# EAGLE design DTMF (EAGLE 6.5.0)
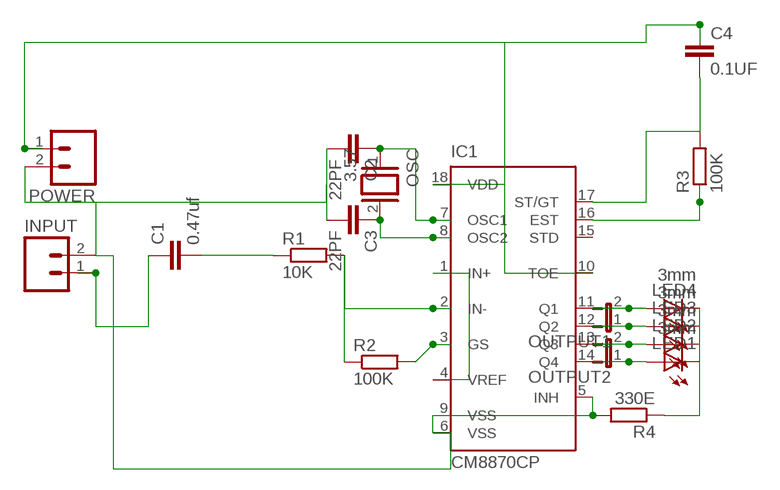
[diagram p0: schematic, sheet 1]

## Parts
C1  0.47uf  C2.5/2  [C2.5-2]
C2  22PF  C2.5/2  [C2.5-2]
C3  22PF  C2.5/2  [C2.5-2]
C4  0.1UF  C2.5/2  [C2.5-2]
IC1  CM8870CP  [DIL18]
INPUT  M02  [02P]
LED1  3mm  LED3MM  [LED3MM]
LED2  3mm  LED3MM  [LED3MM]
LED3  3mm  LED3MM  [LED3MM]
LED4  3mm  LED3MM  [LED3MM]
OSC  3.57  XTAL/S  [QS]
OUTPUT1  JP1E  [JP1]
OUTPUT2  JP1E  [JP1]
POWER  M02  [02P]
R1  10K  R-EU_0204/7  [0204/7]
R2  100K  R-EU_0204/7  [0204/7]
R3  100K  R-EU_0204/7  [0204/7]
R4  330E  R-EU_0204/7  [0204/7]

## Nets
N$1: C2.2 C3.2 IC1.5(INH) IC1.6(VSS) IC1.9(VSS) INPUT.2 POWER.2 R4.2
N$2: C1.2 R1.1
N$3: IC1.3(GS) R2.2
N$4: LED1.K(C) LED2.K(C) LED3.K(C) LED4.K(C) R4.1
N$5: IC1.11(Q1) LED4.A OUTPUT1.2
N$6: IC1.12(Q2) LED3.A OUTPUT1.1
N$7: IC1.13(Q3) LED2.A OUTPUT2.2
N$8: IC1.14(Q4) LED1.A OUTPUT2.1
N$10: C4.1 IC1.10(TOE) IC1.18(VDD) POWER.1
N$11: C1.1 INPUT.1
N$12: IC1.2(IN-) R1.2 R2.1
N$13: IC1.1(IN+) IC1.4(VREF)
N$14: C2.1 IC1.7(OSC1) OSC.1
N$15: C3.1 IC1.8(OSC2) OSC.2
N$17: IC1.16(EST) R3.1
N$24: C4.2 IC1.17(ST/GT) R3.2
Unconnected: IC1.15(STD)

## Library data of the parts
C1-C4 = capacitor-wima:C: CAPACITOR naming: grid - package width
IC1 = california-micro-devices:CM8870C: CMOS Integrated DTMF Receiver cm8870.pdf; OC_FARNELL: unknown; OC_NEWARK: unknown
INPUT POWER = con-amp-quick:M02: AMP QUICK CONNECTOR; OC_FARNELL: unknown; OC_NEWARK: unknown
LED1-LED4 = led:LED: LED OSRAM: - CHIPLED LG R971, LG N971, LY N971, LG Q971, LY Q971, LO R971, LY R971 LH N974, LH R974 LS Q976, LO Q976, LY Q976 LO Q996 - Hyper CHIPLED LW Q18S LB Q993, LB Q99A, LB R99A - SideLED LS A670, LO A670, LY A670, LG A670, LP A670 LB A673, LV A673, LT A673, LW A673 LH A674 LY A675 LS A676, LA A676, LO A676, LY A676, LW A676 LS A679, LY A679, LG A679 - Hyper Micro SIDELED® LS Y876, LA Y876, LO Y876, LY Y876 LT Y87S - SmartLED LW L88C, LW L88S LB L89C, LB L89S, LG L890 LS L89K, LO L89K, LY L89K LS L896, LA L896, LO L896, LY L896 - TOPLED LS T670, LO T670, LY T670, LG T670, LP T670 LSG T670, LSP T670, LSY T670, LOP T670, LYG T670 LG T671, LOG T671, LSG T671 LB T673, LV T673, LT T673, LW T673 LH T674 LS T676, LA T676, LO T676, LY T676, LB T676, LH T676, LSB T676, LW T676 LB T67C, LV T67C, LT T67C, LS T67K, LO T67K, LY T67K, LW E67C LS E67B, LA E67B, LO E67B, LY E67B, LB E67C, LV E67C, LT E67C LW T67C LS T679, LY T679, LG T679 LS T770, LO T770, LY T770, LG T770, LP T770 LB T773, LV T773, LT T773, LW T773 LH T774 LS E675, LA E675, LY E675, LS T675 LS T776, LA T776, LO T776, LY T776, LB T776 LHGB T686 LT T68C, LB T68C - Hyper Mini TOPLED® LB M676 - Mini TOPLED Santana® LG M470 LS M47K, LO M47K, LY M47K Source: http://www.osram.convergy.de LUXEON: - LUMILED® LXK2-PW12-R00, LXK2-PW12-S00, LXK2-PW14-U00, LXK2-PW14-V00 LXK2-PM12-R00, LXK2-PM12-S00, LXK2-PM14-U00 LXK2-PE12-Q00, LXK2-PE12-R00, LXK2-PE12-S00, LXK2-PE14-T00, LXK2-PE14-U00 LXK2-PB12-K00, LXK2-PB12-L00, LXK2-PB12-M00, LXK2-PB14-N00, LXK2-PB14-P00, LXK2-PB14-Q00 LXK2-PR12-L00, LXK2-PR12-M00, LXK2-PR14-Q00, LXK2-PR14-R00 LXK2-PD12-Q00, LXK2-PD12-R00, LXK2-PD12-S00 LXK2-PH12-R00, LXK2-PH12-S00 LXK2-PL12-P00, LXK2-PL12-Q00, LXK2-PL12-R00 Source: www.luxeon.com KINGBRIGHT: KA-3528ASYC Source: www.kingbright.com
OSC = special:XTAL/S: CRYSTAL
OUTPUT1 OUTPUT2 = jumper:JP1E: JUMPER
R1-R4 = rcl:R-EU_: RESISTOR, European symbol

## Board
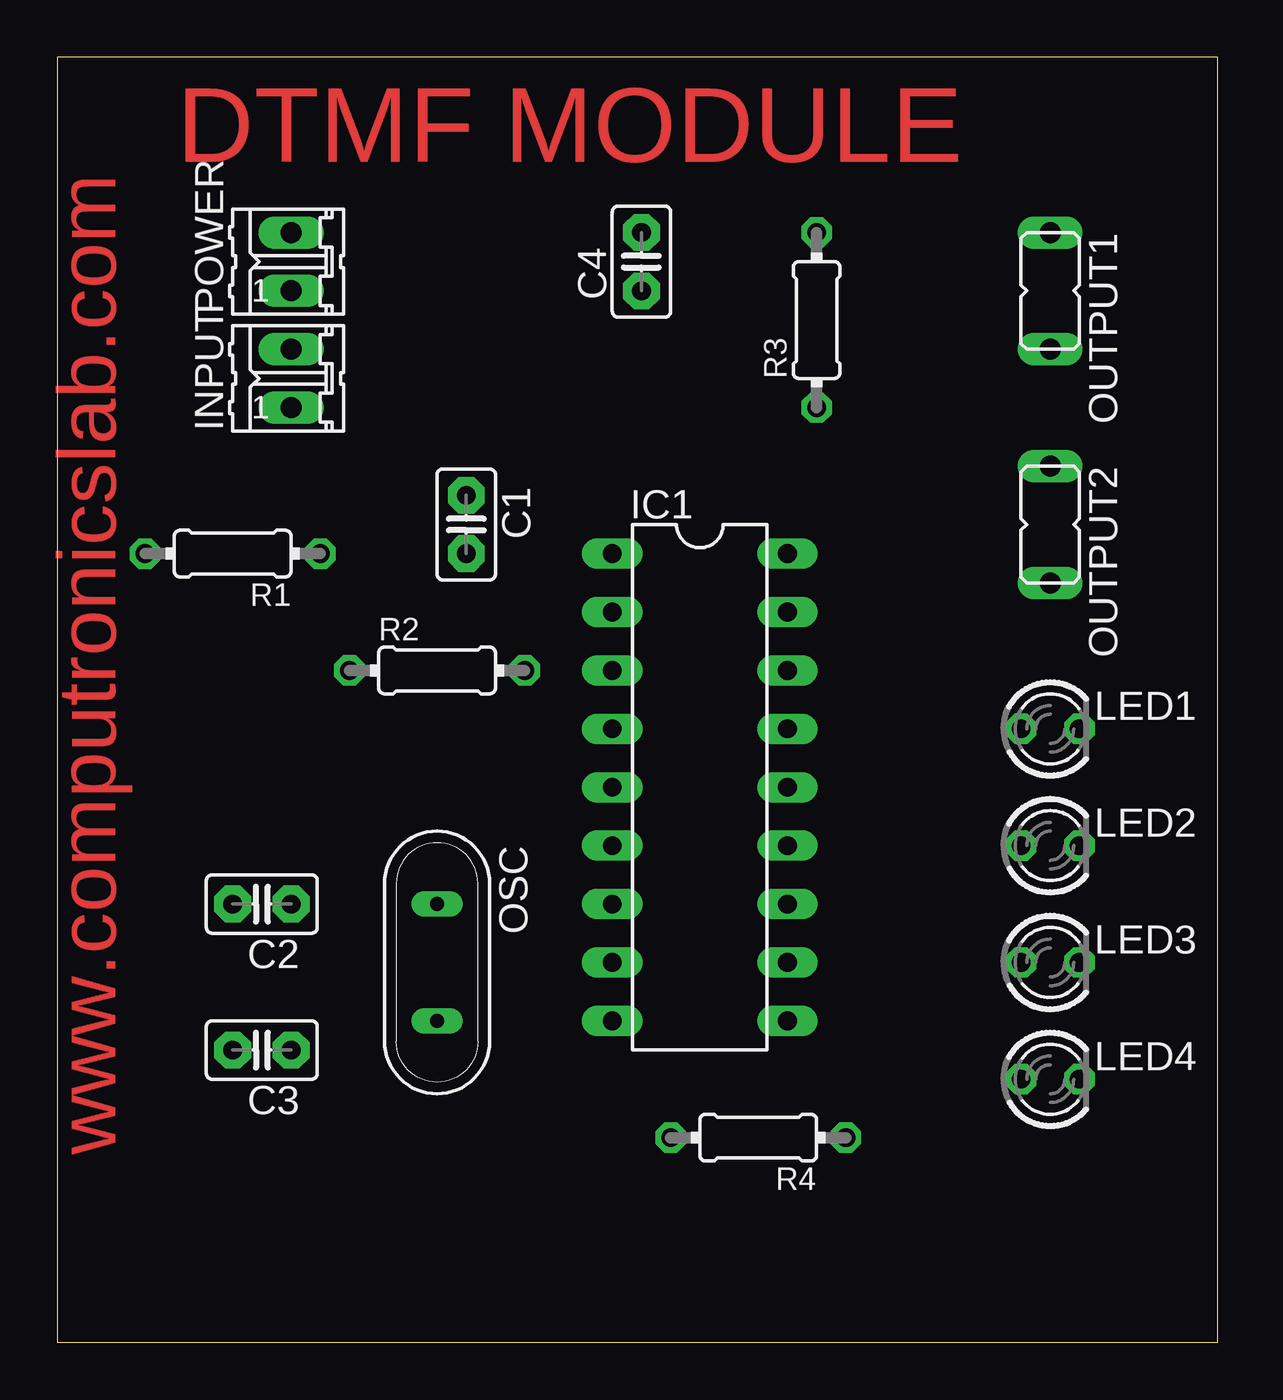
[diagram p1: board, top side]
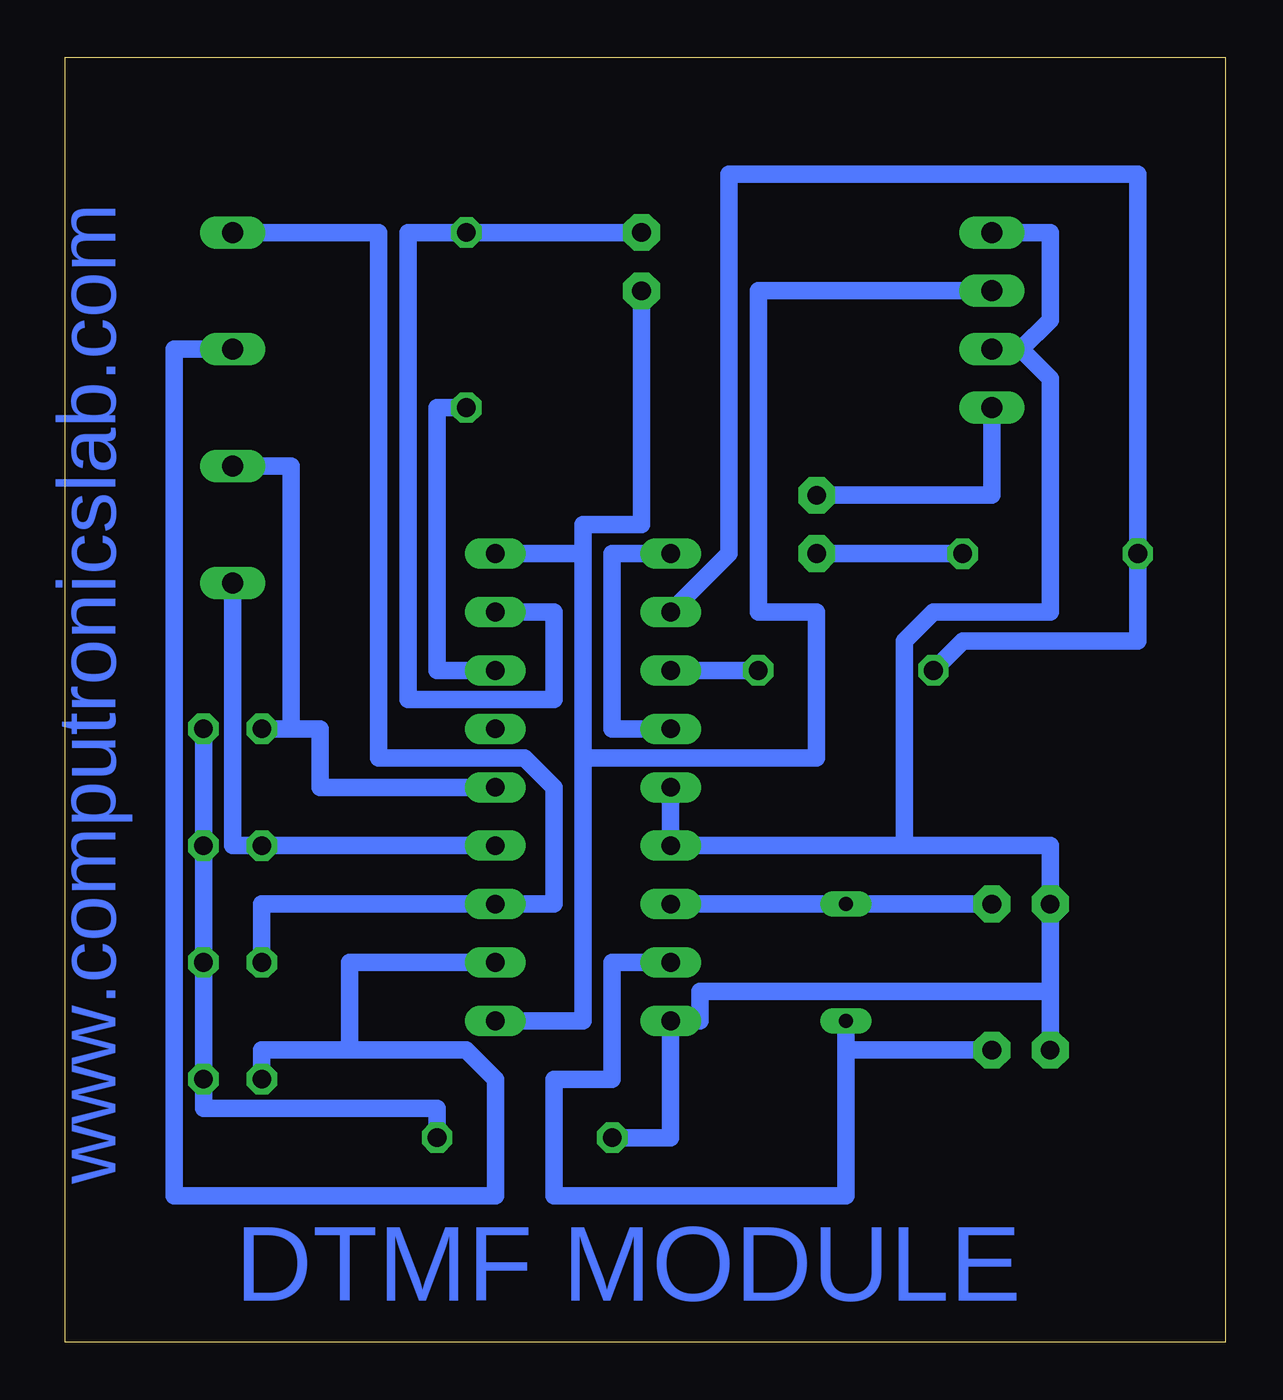
[diagram p2: board, bottom side, seen from below]

Size 50.47 x 55.87 mm. Coordinates in mm from the lower left corner, seen from the top.
Outline: 0,0 50.47,0 50.47,55.87 0,55.87 0,0
Copper layers (1*16): Top 0.035mm / dielectric 1.5mm / Bottom 0.035mm
Design rules "default *": minimum track width 30mil, minimum drill 24mil, track to track 8mil, track to pad 8mil, pad to pad 8mil, via to via 8mil, smd to smd 8mil, copper to edge 40mil, drill to drill 8mil, minimum pad ring 10mil, minimum via ring 8mil, stop-mask expansion 4mil, vias tented up to drill 0mil, thermal gap 10mil

### Footprints (pad centres in the part's own frame; a part is rotated, then mirrored left to right if it is on the bottom)
C2.5-2 = drill 0.813 pad 1.6 octagon: 1 -1.27,0; 2 1.27,0
DIL18 = drill 0.813 long: 1 -10.16,-3.81; 2 -7.62,-3.81; 3 -5.08,-3.81; 4 -2.54,-3.81; 5 0,-3.81; 6 2.54,-3.81; 7 5.08,-3.81; 8 7.62,-3.81; 9 10.16,-3.81; 10 10.16,3.81; 11 7.62,3.81; 12 5.08,3.81; 13 2.54,3.81; 14 0,3.81; 15 -2.54,3.81; 16 -5.08,3.81; 17 -7.62,3.81; 18 -10.16,3.81
02P = drill 0.914 long: 1 -1.27,0; 2 1.27,0
LED3MM = drill 0.813 octagon: A -1.27,0; K 1.27,0
QS = drill 0.61 long: 1 -2.54,0; 2 2.54,0
JP1 = drill 0.914 long: 1 0,-2.54; 2 0,2.54
0204/7 = drill 0.813 octagon: 1 -3.81,0; 2 3.81,0

### Placement (x,y rotation side)
C1  17.78,35.56 270 top
C2  8.89,19.05 180 top
C3  8.89,12.7 180 top
C4  25.4,46.99 90 top
IC1  27.94,24.13 270 top
INPUT  10.16,41.91 90 top
LED1  43.18,26.67 0 top
LED2  43.18,21.59 0 top
LED3  43.18,16.51 0 top
LED4  43.18,11.43 0 top
OSC  16.51,16.51 270 top
OUTPUT1  43.18,45.72 180 top
OUTPUT2  43.18,35.56 180 top
POWER  10.16,46.99 90 top
R1  7.62,34.29 180 top
R2  16.51,29.21 0 top
R3  33.02,44.45 90 top
R4  30.48,8.89 180 top

### Tracks (layer width: path | path; a pad name or v marks a point on that pad's centre or on a via)
N$1
  Bottom 0.762: R4.2 24.13,8.89 IC1.9 22.86,13.97 22.86,15.24 7.62,15.24 | 8.89,43.18 INPUT.2 8.89,43.18 | 8.89,43.18 7.62,44.45 7.62,48.26 POWER.2 | IC1.5 IC1.6 13.97,21.59 | 7.62,15.24 C2.2 7.62,21.59 10.16,21.59 13.97,21.59 | 7.62,15.24 C3.2 | 8.89,43.18 7.62,41.91 7.62,31.75 12.7,31.75 13.97,30.48 13.97,21.59
N$2
  Bottom 0.762: C1.2 R1.1
N$3
  Bottom 0.762: IC1.3 R2.2
N$4
  Bottom 0.762: LED1.K LED2.K LED3.K LED4.K 44.45,10.16 43.18,10.16 35.56,10.16 34.29,10.16 R4.1
N$5
  Bottom 0.762: 40.64,12.7 38.1,12.7 38.1,16.51 36.83,16.51 IC1.11 | 40.64,12.7 41.91,12.7 LED4.A | OUTPUT1.2 45.72,43.18 45.72,40.64 45.72,7.62 45.72,6.35 31.75,6.35 31.75,8.89 31.75,11.43 33.02,12.7 40.64,12.7
N$6
  Bottom 0.762: LED3.A 41.91,19.05 39.37,19.05 IC1.12 29.21,19.05 29.21,24.13 30.48,25.4 36.83,25.4 36.83,41.91 36.83,48.26 OUTPUT1.1
N$7
  Bottom 0.762: IC1.13 LED2.A 43.18,21.59 OUTPUT2.2
N$8
  Bottom 0.762: IC1.14 39.37,24.13 39.37,26.67 LED1.A 40.64,26.67 40.64,35.56 40.64,38.1 OUTPUT2.1
N$10
  Bottom 0.762: IC1.10 27.94,13.97 27.94,17.78 27.94,25.4 | 27.94,34.29 27.94,25.4 | IC1.18 29.21,34.29 | 29.21,34.29 27.94,34.29 | POWER.1 11.43,45.72 20.32,45.72 20.32,36.83 20.32,31.75 17.78,31.75 17.78,30.48 17.78,25.4 19.05,25.4 27.94,25.4 | C4.1 25.4,35.56 27.94,35.56 27.94,34.29 | 29.21,34.29 27.94,34.29
N$11
  Bottom 0.762: INPUT.1 10.16,38.1 10.16,36.83 13.97,36.83 C1.1
N$12
  Bottom 0.762: R2.1 11.43,30.48 6.35,30.48 3.81,30.48 3.81,31.75 3.81,33.02 R1.2 3.81,46.99 3.81,49.53 3.81,50.8 7.62,50.8 21.59,50.8 21.59,34.29 IC1.2
N$13
  Bottom 0.762: IC1.4 26.67,26.67 26.67,27.94 26.67,29.21 26.67,34.29 IC1.1
N$14
  Bottom 0.762: C2.1 OSC.1 IC1.7
N$15
  Bottom 0.762: C3.1 15.24,12.7 16.51,12.7 16.51,11.43 OSC.2 16.51,7.62 16.51,6.35 26.67,6.35 | 26.67,13.97 26.67,12.7 | 26.67,12.7 26.67,13.97 | 26.67,13.97 26.67,16.51 IC1.8 | 26.67,6.35 29.21,6.35 | 29.21,6.35 29.21,7.62 | 29.21,7.62 29.21,11.43 26.67,11.43 26.67,12.7 | 26.67,12.7 26.67,13.97 | 26.67,6.35 29.21,6.35 | 29.21,6.35 29.21,7.62
N$17
  Bottom 0.762: IC1.16 34.29,29.21 34.29,31.75 34.29,40.64 R3.1
N$24
  Bottom 0.762: IC1.17 29.21,31.75 29.21,29.21 29.21,27.94 33.02,27.94 35.56,27.94 35.56,30.48 35.56,48.26 R3.2 C4.2

### Text on the board
Top: DTMF MODULE | www.computronicslab.com
Bottom: www.computronicslab.com | DTMF MODULE